# EAGLE schematic shrew-mini (EAGLE 7.6.0)
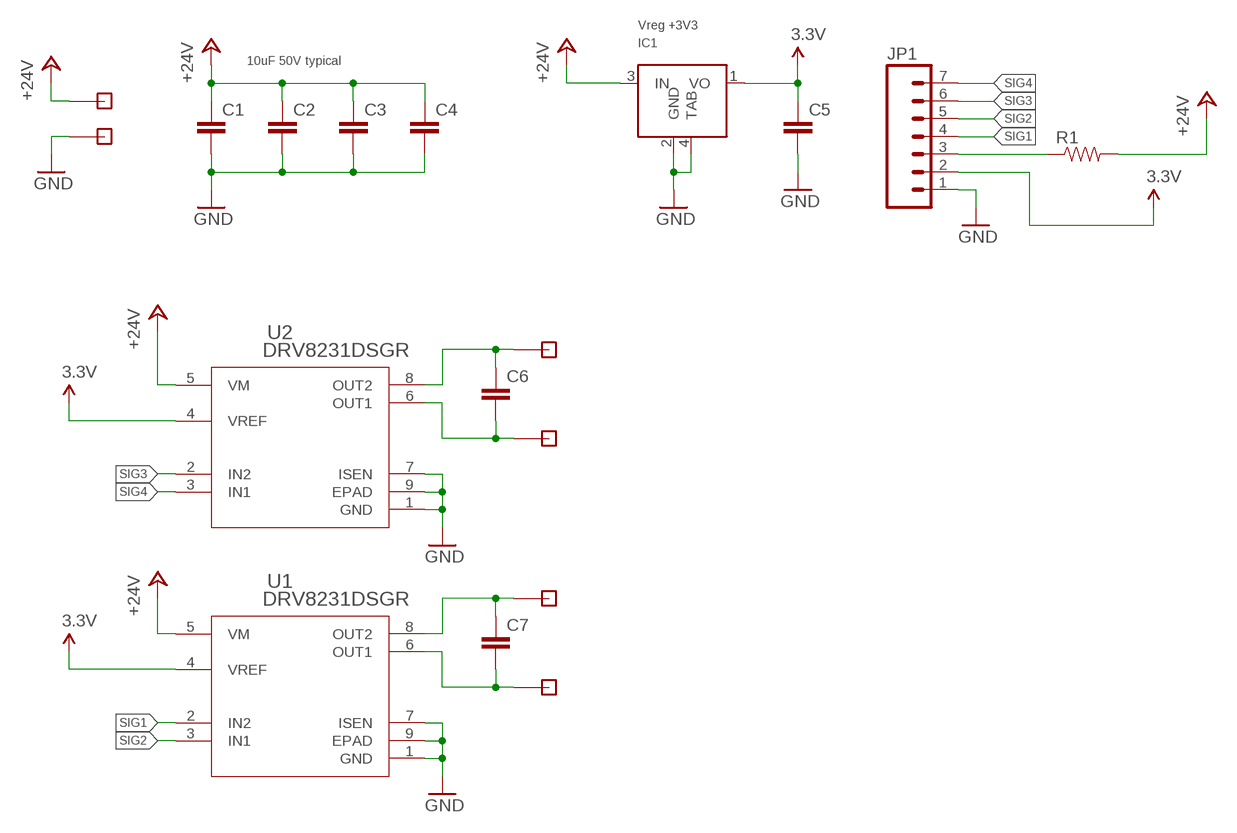
[diagram p0: schematic, sheet 1]

## Parts
C1  CAP0805  [0805]
C2  CAP0805  [0805]
C3  CAP0805  [0805]
C4  CAP0805  [0805]
C5  CAP0805  [0805]
C6  CAP0402-CAP  [0402-CAP]
C7  CAP0402-CAP  [0402-CAP]
IC1  Vreg +3V3  V_REG_SOT89-SOT89  [SOT89]
JP1  M07-2MM-TH  [1X07-2MM-TH]
R1  RESISTOR0402-RES  [0402-RES]
U1  DRV8231DSGR  [WSON8_DRV8231_TEX]
U2  DRV8231DSGR  [WSON8_DRV8231_TEX]
X1  PIN-1X-BIG  [PAD-1X-BIG]
X2  PIN-1X-BIG  [PAD-1X-BIG]
X3  PIN-1X-BIG  [PAD-1X-BIG]
X4  PIN-1X-BIG  [PAD-1X-BIG]
X5  PIN-1X-1.5MMSQ  [PAD-1X-1.5MMSQ]
X6  PIN-1X-MED  [PAD-1X-MED]

## Nets
3.3V: C5.1 IC1.1(VO) JP1.2 U1.4(VREF) U2.4(VREF)
+24V: C1.1 C2.1 C3.1 C4.1 IC1.3(IN) R1.2 U1.5(VM) U2.5(VM) X5.P$1
GND: C1.2 C2.2 C3.2 C4.2 C5.2 IC1.2(GND) IC1.4(TAB) JP1.1 U1.1(GND) U1.7(ISEN) U1.9(EPAD) U2.1(GND) U2.7(ISEN) U2.9(EPAD) X6.P$1
MOTOR1: C7.2 U1.6(OUT1) X3.1
MOTOR2: C7.1 U1.8(OUT2) X4.1
MOTOR3: C6.2 U2.6(OUT1) X1.1
MOTOR4: C6.1 U2.8(OUT2) X2.1
SIG1: JP1.4 U1.2(IN2)
SIG2: JP1.5 U1.3(IN1)
SIG3: JP1.6 U2.2(IN2)
SIG4: JP1.7 U2.3(IN1)
V-ADC: JP1.3 R1.1

## Notes on the sheet
- 10uF 50V typical

## Library data of the parts
C1-C7 = shrew-common:CAP: Capacitor Standard 0603 ceramic capacitor, and 0.1" leaded capacitor.
IC1 = shrew-common:V_REG_SOT89
JP1 = shrew-common:M07: Header 7 Standard 7-pin 0.1" header. Use with straight break away headers (SKU : PRT-00116), right angle break away headers (PRT-00553), swiss pins (PRT-00743), machine pins (PRT-00117), and female headers (PRT-00115). NOTES ON THE VARIANTS LOCK and LOCK_LONGPADS... This footprint was designed to help hold the alignment of a through-hole component (i.e. 7-pin header) while soldering it into place. You may notice that each hole has been shifted either up or down by 0.005 of an inch from it's more standard position (which is usually a perfectly straight line). This slight alteration caused the pins (the squares in the middle) to touch the edges of the holes. Because they are alternating, it causes a "brace" to hold the header in place. 0.005 has proven to be the perfect amount of "off-center" position when using our standard breakaway headers. Although looks a little odd when you look at the bare footprint, once you have a header in there, the alteration is very hard to notice. Also, if you push a header all the way into place, it is covered up entirely on the bottom side. This idea of altering the position of holes to aid alignment will be further integrated into the Sparkfun Library for other footprints. It can help hold any component with 3 or more connection pins.
R1 = shrew-common:RESISTOR: Resistor Basic schematic elements and footprints for 0603, 1206, and PTH resistors.
U1 U2 = shrew-core:DRV8231DSGR; COPYRIGHT: Copyright (C) 2024 Ultra Librarian. All rights reserved.; MANUFACTURER_PART_NUMBER: DRV8231DSGR; MFR_NAME: Texas Instruments
X1-X6 = shrew-core:PIN-1X